# EasyEDA Pro project 2025NUEDC_A_Project.eprj, schematic Schematic1_2
Board Name: Board1_1; Create Date: 2025-07-18; Page Name: P1; Project Name: 三相逆变器; Schematic Name: Schematic1_1; Update Date: 2025-07-18; Company: 嘉立创EDA; Page Size: A4; Version: V1.0
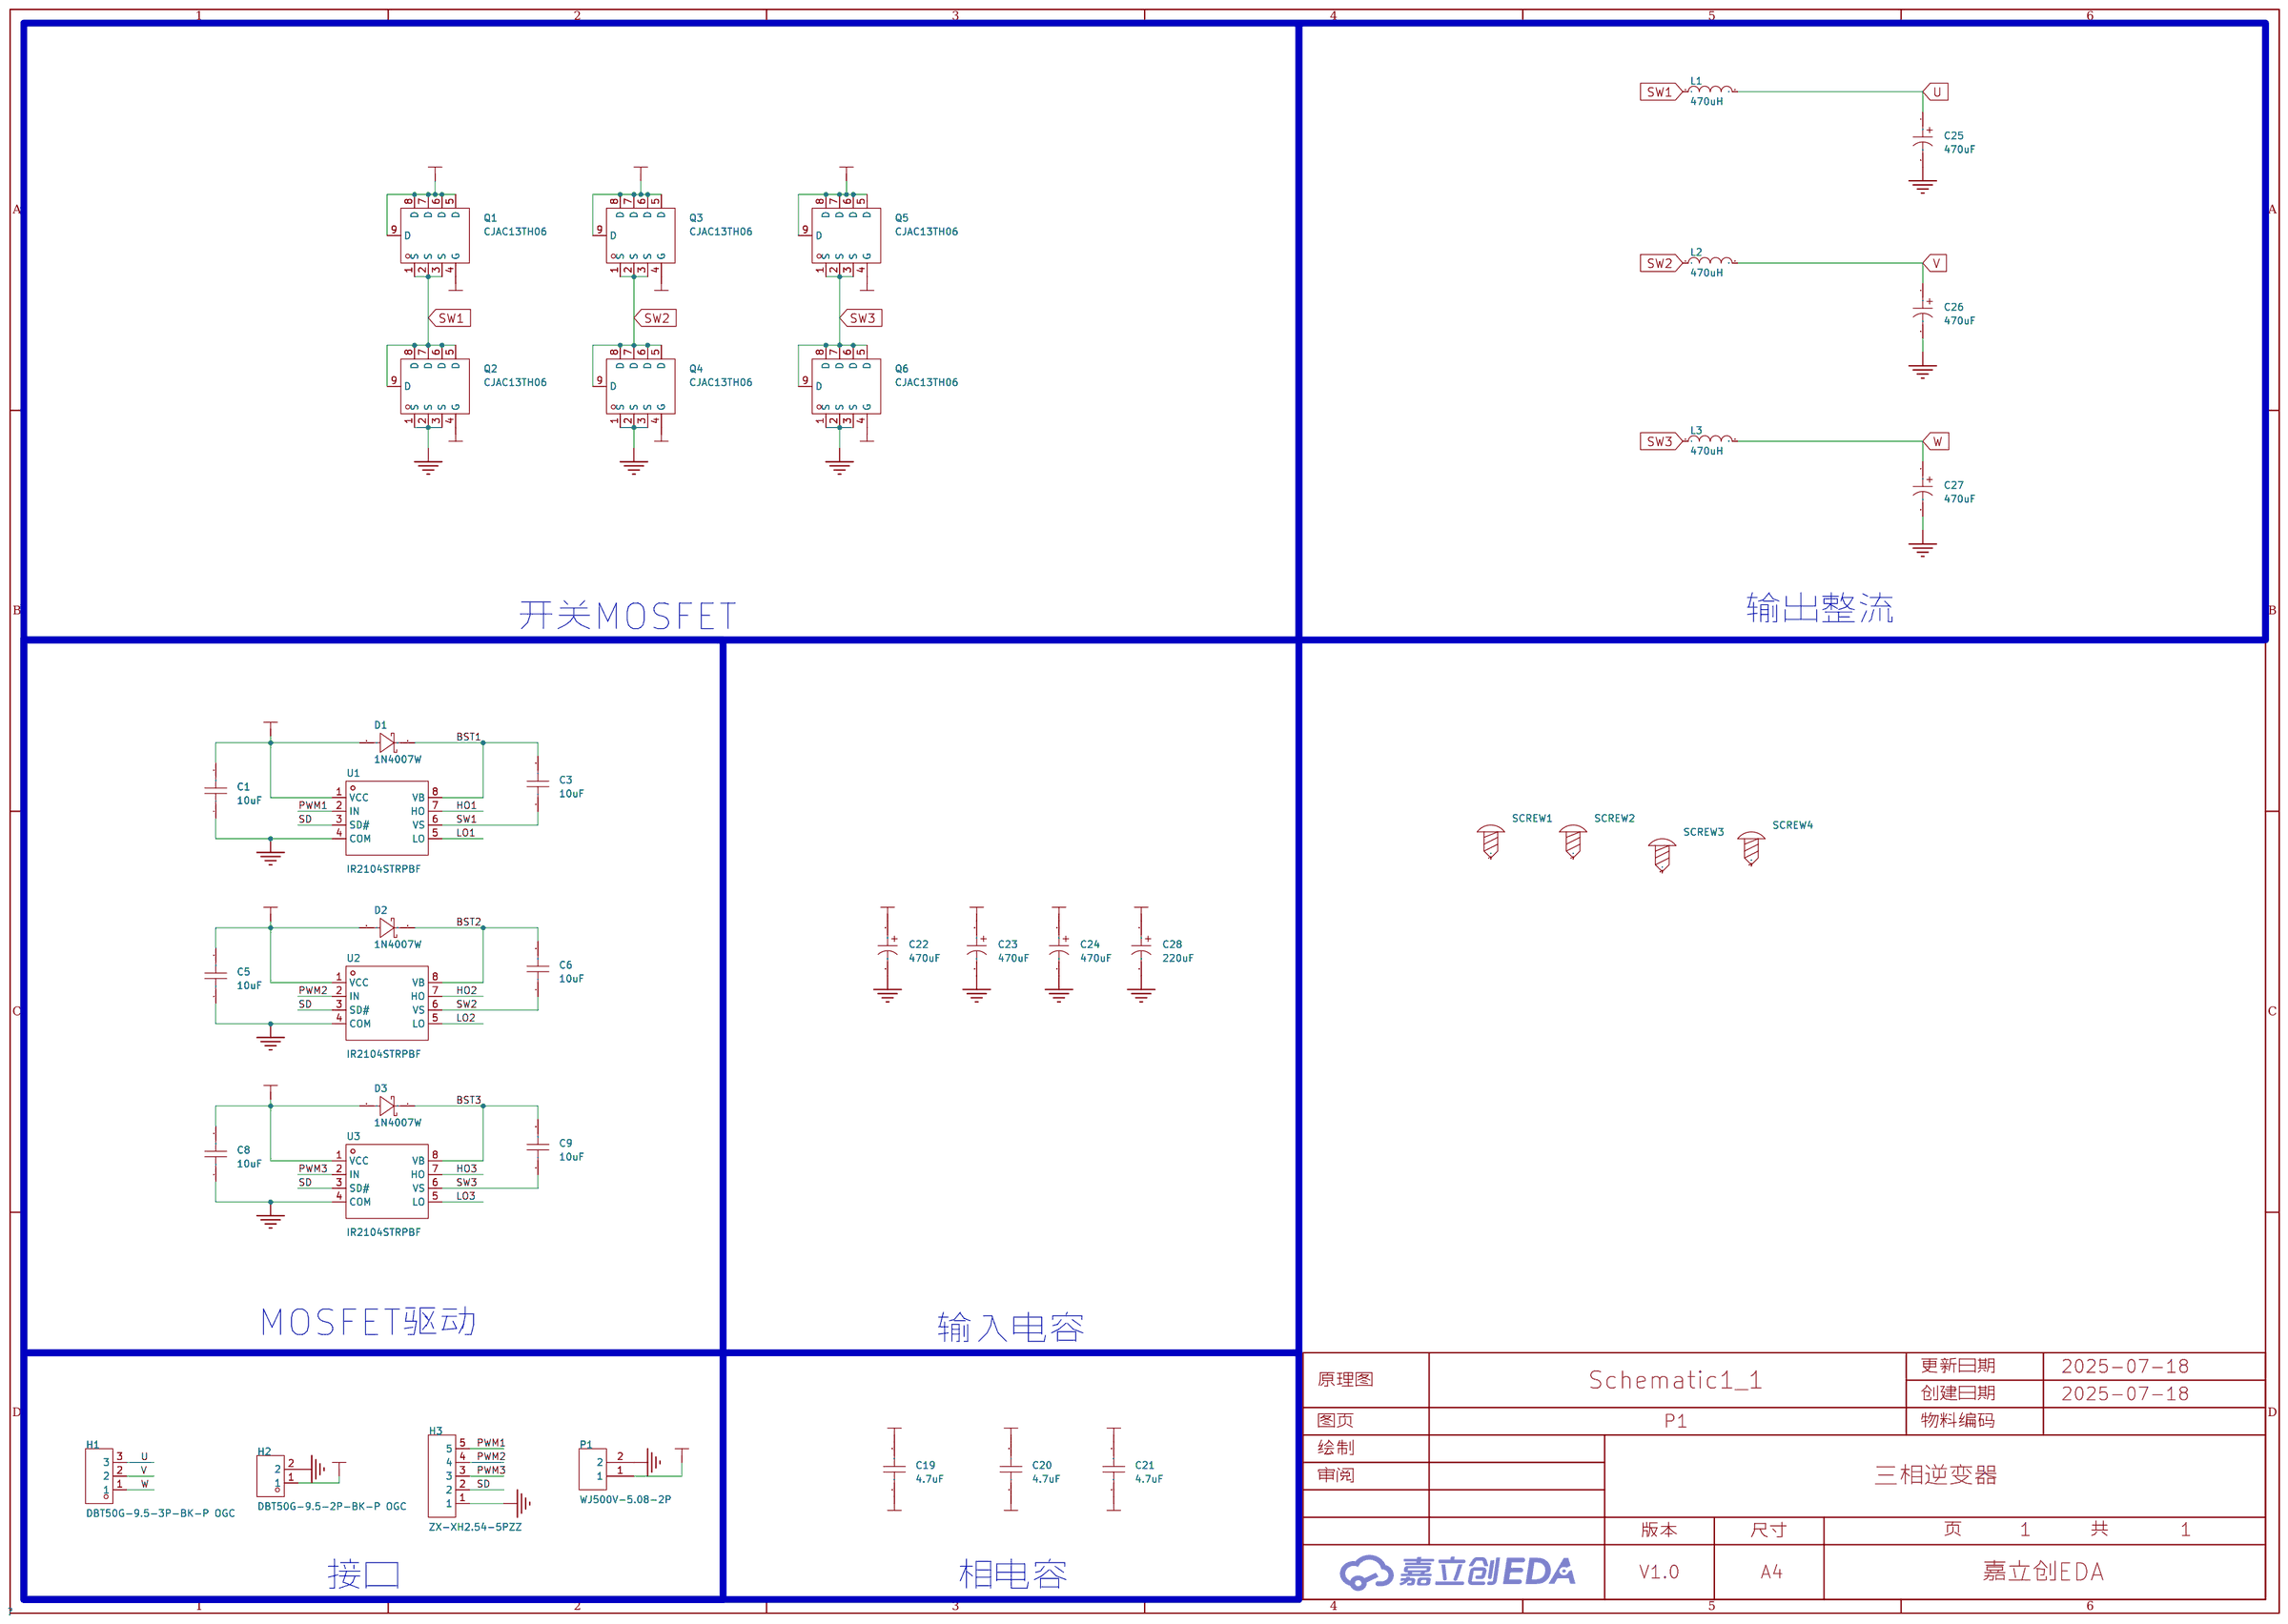
[diagram p1: schematic sheet]

## Parts
C1  10uF  [C0805]
C3  10uF  [C0805]
C5  10uF  [C0805]
C6  10uF  [C0805]
C8  10uF  [C0805]
C9  10uF  [C0805]
C19  4.7uF  [CAP-TH_L24.0-W14.5-P22.5-D0.8]
C20  4.7uF  [CAP-TH_L24.0-W14.5-P22.5-D0.8]
C21  4.7uF  [CAP-TH_L24.0-W14.5-P22.5-D0.8]
C22  470uF  [CAP-TH_BD13.0-P5.00-D0.6-FD]
C23  470uF  [CAP-TH_BD13.0-P5.00-D0.6-FD]
C24  470uF  [CAP-TH_BD13.0-P5.00-D0.6-FD]
C25  470uF  [CAP-TH_BD13.0-P5.00-D0.6-FD]
C26  470uF  [CAP-TH_BD13.0-P5.00-D0.6-FD]
C27  470uF  [CAP-TH_BD13.0-P5.00-D0.6-FD]
C28  220uF  [CAP-TH_BD8.0-P3.50-D0.6-FD]
D1  1N4007W  [SOD-123FL_L2.7-W1.8-LS3.8-RD]
D2  1N4007W  [SOD-123FL_L2.7-W1.8-LS3.8-RD]
D3  1N4007W  [SOD-123FL_L2.7-W1.8-LS3.8-RD]
H1  DBT50G-9.5-3P-BK-P OGC  [CONN-TH_3P-P9.50_DBT50G-9.5-3P]
H2  DBT50G-9.5-2P-BK-P OGC  [CONN-TH_2P-P9.50_DBT50G-9.5-2P]
H3  ZX-XH2.54-5PZZ  [CONN-TH_5P-P2.50_ZX-XH2.54-5PZZ]
L1  470uH  [IND-TH_L33.0-W16.0-P17.00-D1.5]
L2  470uH  [IND-TH_L33.0-W16.0-P17.00-D1.5]
L3  470uH  [IND-TH_L33.0-W16.0-P17.00-D1.5]
P1  WJ500V-5.08-2P  [CONN-TH_2P-P5.00_WJ500V-5.08-2P]
Q1  CJAC13TH06  [PDFN-8_L5.8-W4.9-P1.27-LS6.1-BL]
Q2  CJAC13TH06  [PDFN-8_L5.8-W4.9-P1.27-LS6.1-BL]
Q3  CJAC13TH06  [PDFN-8_L5.8-W4.9-P1.27-LS6.1-BL]
Q4  CJAC13TH06  [PDFN-8_L5.8-W4.9-P1.27-LS6.1-BL]
Q5  CJAC13TH06  [PDFN-8_L5.8-W4.9-P1.27-LS6.1-BL]
Q6  CJAC13TH06  [PDFN-8_L5.8-W4.9-P1.27-LS6.1-BL]
SCREW1  -  [M3螺丝]
SCREW2  -  [M3螺丝]
SCREW3  -  [M3螺丝]
SCREW4  -  [M3螺丝]
U1  IR2104STRPBF  [SOIC-8_L4.9-W3.9-P1.27-LS6.0-BL]
U2  IR2104STRPBF  [SOIC-8_L4.9-W3.9-P1.27-LS6.0-BL]
U3  IR2104STRPBF  [SOIC-8_L4.9-W3.9-P1.27-LS6.0-BL]

## Library data of the parts
C1 C5 C8 = CAP_0805: Supplier Footprint: 0805
C3 C6 C9 = GRM21BR61H106KE43L: 容值:10uF;精度:±10%;额定电压:50V;材质(温度系数):X5R;; LCSC Part Name: 10uF ±10% 50V; Supplier Part: C440198; Manufacturer: muRata(村田); Supplier Footprint: 0805; JLCPCB Part Class: Basic Part; Datasheet: https://atta.szlcsc.com/upload/public/pdf/source/20230811/95AAE0C9AF55EDC31B7A4D8B733F534E.pdf; Supplier: LCSC; Tolerance: ±10%; Voltage Rated: 50V; Temperature Coefficient: X5R
C19-C21 = KP475J2E2202: 容值:4.7uF;精度:±5%;额定电压:250V;工作温度:-40℃~+100℃;; LCSC Part Name: 4.7uF ±5% 250V; Supplier Part: C3019077; Manufacturer: KYET(科雅); Supplier Footprint: 插件,P=22.5mm; JLCPCB Part Class: 扩展库; Datasheet: https://atta.szlcsc.com/upload/public/pdf/source/20220523/5B3707700456AD85B02A37774602E43E.pdf; Supplier: LCSC; Tolerance: ±5%; Voltage Rated: 250V; Operating Temperature: -40℃~+100℃
C22-C27 = ERG63V470M13X21: 容值:470uF;精度:±20%;额定电压:63V;纹波电流:860mA@100kHz;等效串联电阻(ESR):100mΩ@100kHz;; LCSC Part Name: 470uF ±20% 63V; Supplier Part: C47344187; Manufacturer: 捷而瑞; Supplier Footprint: 插件,D13xL21mm; JLCPCB Part Class: 扩展库; Datasheet: https://atta.szlcsc.com/upload/public/pdf/source/20250526/717B4C76834FE5C4A331D19A222D031C.pdf; Supplier: LCSC; Tolerance: ±20%; Voltage Rating: 63V; Ripple Current: 860mA@100kHz; Equivalent Series Resistance(ESR): 100mΩ@100kHz; Pin Spacing: 5mm; Diameter: 13mm; Height - Seated (Max): 21mm; Lifetime: 2000hrs@105℃; Operating Temperature: -40℃~+105℃
C28 = 01EC3470: 容值:220uF;精度:±20%;额定电压:50V;纹波电流:350mA@120kHz;等效串联电阻(ESR):-;; LCSC Part Name: 220uF ±20% 50V; Supplier Part: C2836445; Manufacturer: KNSCHA(科尼盛); Supplier Footprint: 插件,D8xL12mm; JLCPCB Part Class: 扩展库; Datasheet: https://atta.szlcsc.com/upload/public/pdf/source/20210528/C2836445_4EB3DEC3C45633977FB5495C9B2E1697.pdf; Supplier: LCSC; Tolerance: ±20%; Voltage Rating: 50V; Ripple Current: 350mA@120kHz; Pin Spacing: 3.5mm; Diameter: 8mm; Height - Seated (Max): 12mm; Lifetime: 2000hrs@105℃; Operating Temperature: -40℃~+105℃
D1-D3 = 1N4007W_C18199088: 二极管配置:独立式;正向压降(Vf):1V@1.0A;直流反向耐压(Vr):1kV;整流电流:1A;; Supplier Part: C18199088; Manufacturer: 宏迦橙; Supplier Footprint: SOD-123FL; JLCPCB Part Class: Extended Part; Datasheet: https://atta.szlcsc.com/upload/public/pdf/source/20230925/B0AB2B510D392D7083D021E804ED238F.pdf; Supplier: LCSC; Diode Configuration: 独立式; Forward Voltage (Vf@If): 1V@1.0A; Reverse Voltage (Vr): 1kV; Rectified Current: 1A; Reverse Leakage Current (Ir): 2uA@1000V
H1 = DBT50G-9.5-3P-BK-P OGC: 隔板类型:带盖板;间距:9.5mm;结构:1x3P;安装方式:直针;引脚位置:边脚;排数:1;额定电流:32A;额定电压:750V;线规 - AWG:12~22;线规 - 平方毫米:4;工作温度范围:-40℃~+105℃;颜色:黑色;每排PIN数:3;; LCSC Part Name: 9.5mm 1x3P 每排P数:3 排数:1 直针 边脚; Supplier Part: C395959; Manufacturer: DORABO(地博电气); Supplier Footprint: 插件,P=9.5mm; JLCPCB Part Class: 扩展库; Datasheet: https://atta.szlcsc.com/upload/public/pdf/source/20221019/84C53DE9D8912EDE417B2211EE296996.pdf; Supplier: LCSC; Barrier Type: 带盖板; Pitch: 9.5mm; Structure: 1x3P; Mounting Style: 直针; Pin Location: 边脚; Number of Pins: 3P; Number of Rows: 1; Current Rating (Max): 32A; Voltage Rating (Max): 750V; Wire Gauge - AWG: 12~22; Wire Gauge - mm2: 4; Operating Temperature Range: -40℃~+105℃; Color: 黑色; Number of PINs Per Row: 3
H2 = DBT50G-9.5-2P-BK-P OGC: 隔板类型:带盖板;间距:9.5mm;结构:1x2P;安装方式:直针;引脚位置:边脚;排数:1;额定电流:32A;额定电压:750V;线规 - AWG:12~22;线规 - 平方毫米:4;工作温度范围:-40℃~+105℃;颜色:黑色;每排PIN数:2;; LCSC Part Name: 9.5mm 1x2P 每排P数:2 排数:1 直针 边脚; Supplier Part: C395958; Manufacturer: DORABO(地博电气); Supplier Footprint: 插件,P=9.5mm; JLCPCB Part Class: 扩展库; Datasheet: https://atta.szlcsc.com/upload/public/pdf/source/20230619/13ADDB604F78DE06B1EFD4F82CE20A46.pdf; Supplier: LCSC; Barrier Type: 带盖板; Pitch: 9.5mm; Structure: 1x2P; Mounting Style: 直针; Pin Location: 边脚; Number of Pins: 2P; Number of Rows: 1; Current Rating (Max): 32A; Voltage Rating (Max): 750V; Wire Gauge - AWG: 12~22; Wire Gauge - mm2: 4; Operating Temperature Range: -40℃~+105℃; Color: 黑色; Number of PINs Per Row: 2
H3 = ZX-XH2.54-5PZZ: 插针结构:1x5P;间距:2.5mm;安装方式:直插;参考系列:XH;总PIN数:5P;排数:1;每排PIN数:5;行距:-;额定电流:3A;触头材质:黄铜;触头镀层:锡;工作温度:-25℃~+85℃;; LCSC Part Name: 1x5P 间距:2.5mm 直插 系列:XH; Supplier Part: C7429635; Manufacturer: Megastar(兆星); Supplier Footprint: 插件,P=2.5mm; JLCPCB Part Class: 扩展库; Datasheet: https://atta.szlcsc.com/upload/public/pdf/source/20230619/60EEF4ADD558E90BFFACF5D939816781.pdf; Supplier: LCSC; Pins Structure: 1x5P; Pitch: 2.5mm; Mounting Type: 直插; Reference Series: XH; Number of Pins: 5P; Number of Rows: 1; Number of PINs Per Row: 5; Current Rating: 3A; Contact Material: 黄铜; Contact Plating: 锡; Operating Temperature: -25℃~+85℃; Voltage Rating: 250V; Plastic Material: PA66; Flame Retardant Rating: UL94V-0; Color: 白色; Z-Height of the Board: 7mm; X-Length of Bottom Edge on Board (Spacing Line): 15mm; Y-Width of Bottom Edge on Board: 5.9mm
L1-L3 = XR106125TS470MV1L: 电感值:47uH;精度:±10%;额定电流:5A;类型:磁环电感;; LCSC Part Name: 47uH ±10% 磁环电感; Supplier Part: C22358528; Manufacturer: XR(祥如); Supplier Footprint: 插件,33x15.6mm; JLCPCB Part Class: 扩展库; Datasheet: https://atta.szlcsc.com/upload/public/pdf/source/20240313/3B46D856669B9C4B865D9288641DA483.pdf; Supplier: LCSC; Tolerance: ±10%; Rated Current: 5A; Type: 磁环电感; Wire Diameter: 1mm
P1 = WJ500V-5.08-2P: 结构:1x2P;间距:5.08mm;颜色:绿色;安装方式:直插;额定电流:18A;额定电压:250V;排数:1;线规 - AWG:14~30;线规 - 平方毫米:2.5;每排PIN数:2;触头材质:-;触头镀层:-;工作温度范围:-40℃~+105℃;焊接温度(最大值):-;; LCSC Part Name: 1x2P 5.08mm 直插 排数:1 每排P数:2; Supplier Part: C8465; Manufacturer: KANGNEX(康奈克斯电气); Supplier Footprint: 插件,P=5.08mm; JLCPCB Part Class: 扩展库; Datasheet: https://atta.szlcsc.com/upload/public/pdf/source/20191225/C8465_02D34CE5B5B4A53DF5891601D97FA9F4.pdf; Supplier: LCSC; Structure: 1x2P; Pitch: 5.08mm; Color: 绿色; Mounting Style: 直插; Current Rating (Max): 18A; Voltage Rating (Max): 250V; Number of Pins: 2P; Number of Rows: 1; Wire Gauge - AWG: 14~30; Wire Gauge - mm2: 2.5; Number of PINs Per Row: 2; Operating Temperature Range: -40℃~+105℃; Screw Specification: M2.5
Q1-Q6 = CJAC13TH06: 类型:1个N沟道;漏源电压(Vdss):60V;连续漏极电流(Id):130A;导通电阻(RDS(on)@Vgs,Id):2.2mΩ@10V;功率(Pd):140W;阈值电压(Vgs(th)@Id):1V@250uA;; LCSC Part Name: 1个N沟道 耐压:60V 电流:130A; Supplier Part: C504082; Manufacturer: CJ(江苏长电/长晶); Supplier Footprint: PQFNWB-8L(5x6); JLCPCB Part Class: 扩展库; Datasheet: https://atta.szlcsc.com/upload/public/pdf/source/20211104/6D1C972394E17010EFF79E24DEBC0797.pdf; Supplier: LCSC; Type: 1个N沟道; Drain Source Voltage (Vdss): 60V; Continuous Drain Current (Id): 130A; Drain Source On Resistance (RDS(on)@Vgs,Id): 2.2mΩ@10V; Power Dissipation (Pd): 140W; Gate Threshold Voltage (Vgs(th)@Id): 1V@250uA; Total Gate Charge (Qg@Vgs): 63.7nC@10V; Input Capacitance (Ciss@Vds): 5.298nF; Reverse Transfer Capacitance (Crss@Vds): 74.8pF; Operating Temperature: -55℃~+150℃
SCREW1-SCREW4 = M3螺丝: Supplier Footprint: 插件
U1-U3 = IR2104STRPBF: 驱动配置:半桥;负载类型:MOSFET；IGBT;驱动通道数:2;峰值灌电流:360mA;峰值拉电流:210mA;电源电压:10V~20V;上升时间:100ns;下降时间:50ns;; Supplier Part: C2960; Manufacturer: Infineon(英飞凌); Supplier Footprint: SOIC-8; JLCPCB Part Class: Extended Part; Datasheet: https://atta.szlcsc.com/upload/public/pdf/source/20140906/1457707236579.pdf; Supplier: LCSC; Driven Configuration: 半桥; Load Type: MOSFET；IGBT; Number of Drivers: 2; Peak Output Current(sink): 360mA; Peak Output Current(source): 210mA; Supply Voltage: 10V~20V; Rise Time: 100ns; Fall Time: 50ns; Operating Temperature: -40℃~+150℃@(Tj)

## Nets
GND: C1.1 C5.1 C8.1 C22.2 C23.2 C24.2 C25.2 C26.2 C27.2 C28.2 H2.2 H3.1 P1.2 Q2.1(S) Q2.2(S) Q2.3(S) Q4.1(S) Q4.2(S) Q4.3(S) Q6.1(S) Q6.2(S) Q6.3(S) U1.4(COM) U2.4(COM) U3.4(COM)
VIN: C22.1 C23.1 C24.1 H2.1 Q1.5(D) Q1.6(D) Q1.7(D) Q1.8(D) Q1.9(D) Q3.5(D) Q3.6(D) Q3.7(D) Q3.8(D) Q3.9(D) Q5.5(D) Q5.6(D) Q5.7(D) Q5.8(D) Q5.9(D)
AUXP: C1.2 C5.2 C8.2 C28.1 D1.2(A) D2.2(A) D3.2(A) P1.1 U1.1(VCC) U2.1(VCC) U3.1(VCC)
BST1: C3.2 D1.1(C) U1.8(VB)
BST2: C6.2 D2.1(C) U2.8(VB)
BST3: C9.2 D3.1(C) U3.8(VB)
HO1: Q1.4(G) U1.7(HO)
HO2: Q3.4(G) U2.7(HO)
HO3: Q5.4(G) U3.7(HO)
LO1: Q2.4(G) U1.5(LO)
LO2: Q4.4(G) U2.5(LO)
LO3: Q6.4(G) U3.5(LO)
PWM1: H3.5 U1.2(IN)
PWM2: H3.4 U2.2(IN)
PWM3: H3.3 U3.2(IN)
SD: H3.2 U1.3(SD#) U2.3(SD#) U3.3(SD#)
SW1: C3.1 L1.1 Q1.1(S) Q1.2(S) Q1.3(S) Q2.5(D) Q2.6(D) Q2.7(D) Q2.8(D) Q2.9(D) U1.6(VS)
SW2: C6.1 L2.1 Q3.1(S) Q3.2(S) Q3.3(S) Q4.5(D) Q4.6(D) Q4.7(D) Q4.8(D) Q4.9(D) U2.6(VS)
SW3: C9.1 L3.1 Q5.1(S) Q5.2(S) Q5.3(S) Q6.5(D) Q6.6(D) Q6.7(D) Q6.8(D) Q6.9(D) U3.6(VS)
U: C19.2 C21.2 C25.1 H1.3 L1.2
V: C19.1 C20.2 C26.1 H1.2 L2.2
W: C20.1 C21.1 C27.1 H1.1 L3.2

Not connected (* = marked no-connect by the designer): SCREW1 1; SCREW2 1; SCREW3 1; SCREW4 1

## Notes on the sheet
- 输出整流
- 开关MOSFET
- MOSFET驱动
- 输入电容
- 接口
- 相电容
